# EAGLE schematic samd21g_minimal_board (EAGLE 9.6.2)
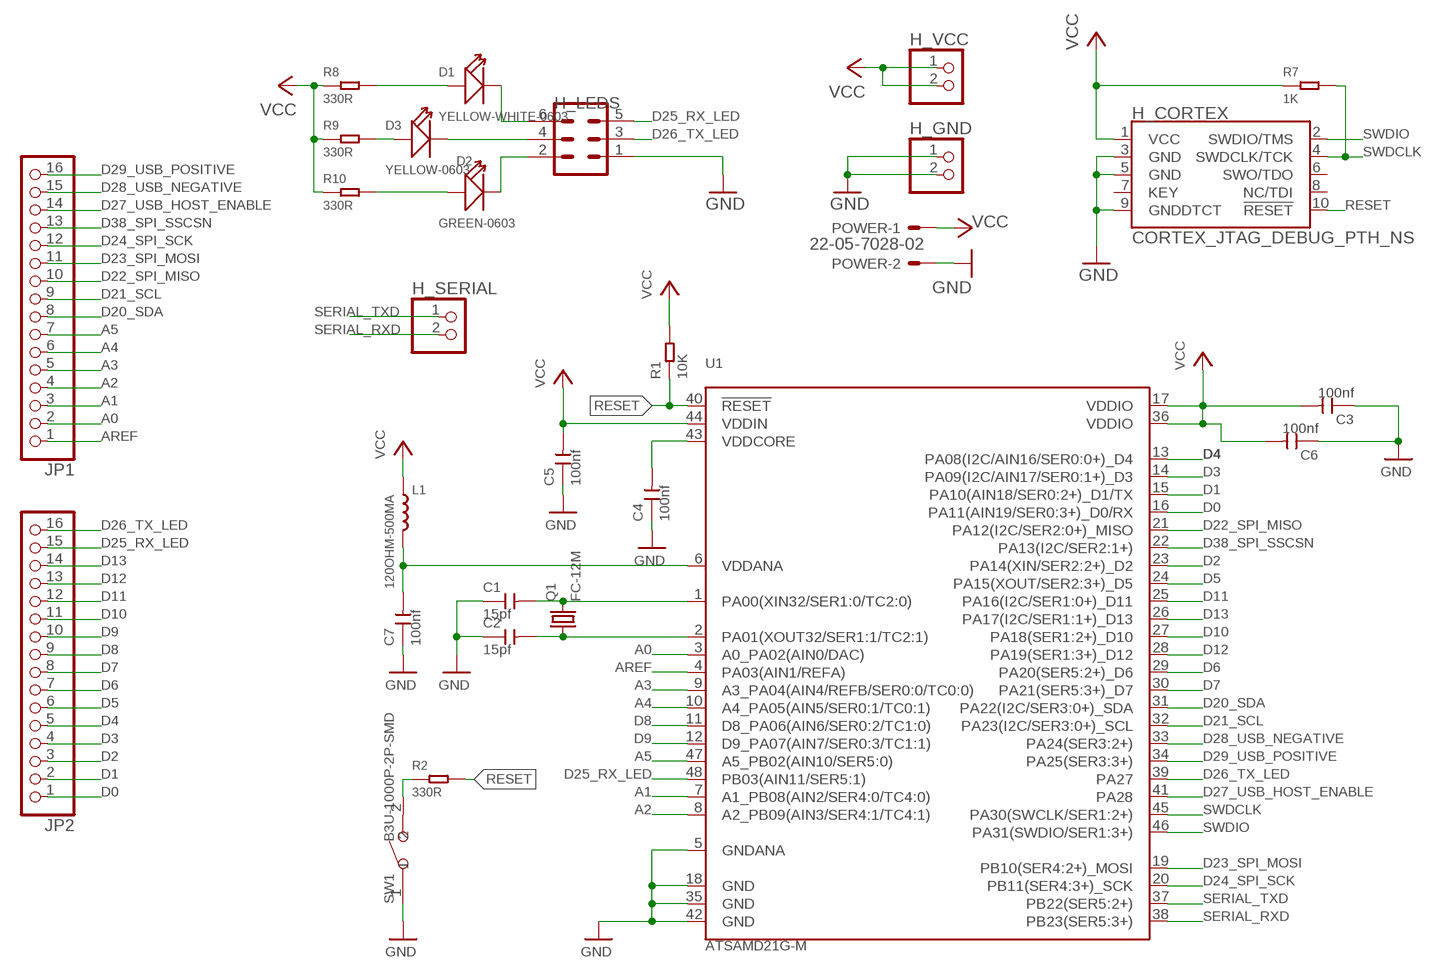
[diagram p0: schematic, sheet 1]

## Parts
C1  15pf  CERAMIC-15PF-50V-5%-NPO(0402)  [C0402]
C2  15pf  CERAMIC-15PF-50V-5%-NPO(0402)  [C0402]
C3  100nf  CERAMIC-100NF-50V-10%-X7R(0805)  [C0805]
C4  100nf  CERAMIC-100NF-50V-10%-X7R(0805)  [C0805]
C5  100nf  CERAMIC-100NF-50V-10%-X7R(0805)  [C0805]
C6  100nf  CERAMIC-100NF-50V-10%-X7R(0805)  [C0805]
C7  100nf  CERAMIC-100NF-50V-10%-X7R(0805)  [C0805]
D1  YELLOW-WHITE-0603  SMD-LED-YELLOW-WHITE(0603)  [LED-0603]
D2  GREEN-0603  SMD-LED-CLEAR-GREEN(0603)  [LED-0603]
D3  YELLOW-0603  SMD-LED-CLEAR-YELLOW(0603)  [LED-0603]
H_CORTEX  CORTEX_JTAG_DEBUG_PTH_NS  [2X5-PTH-1.27MM-NO_SILK]
H_GND  PINHD-1X2  [1X02]
H_LEDS  M_2R03_50MIL-V2  [M_2R03_50MIL-V2]
H_SERIAL  PINHD-1X2  [1X02]
H_VCC  PINHD-1X2  [1X02]
JP1  PINHD-1X16  [1X16]
JP2  PINHD-1X16  [1X16]
L1  120OHM-500MA  SMD-FERRITE-CHIP-120-OHM-500MA(0603)  [L0603]
POWER  22-05-7028-02  [7395-02]
Q1  FC-12M  [FC-12M]
R1  10K  SMD-RES-10K-1%-1/8W(0805)  [R0805]
R2  330R  SMD-RES-330R-1%-1/8W(0805)  [R0805]
R7  1K  SMD-RES-1K-5%-1/8W(0805)  [R0805]
R8  330R  SMD-RES-330R-1%-1/8W(0805)  [R0805]
R9  330R  SMD-RES-330R-1%-1/8W(0805)  [R0805]
R10  330R  SMD-RES-330R-1%-1/8W(0805)  [R0805]
SW1  B3U-1000P-2P-SMD  SMD-BUTTON(2P-3.0X2.5X1.2+0.4MM)-B3U-1000P-2P-SMD  [SW2-2.6-3.0X2.5X1.2+0.4MM]
U1  ATSAMD21G-M  [QFN-48]

## Nets
A0: JP1.2 U1.3(A0_PA02(AIN0/DAC))
A1: JP1.3 U1.7(A1_PB08(AIN2/SER4:0/TC4:0))
A2: JP1.4 U1.8(A2_PB09(AIN3/SER4:1/TC4:1))
A3: JP1.5 U1.9(A3_PA04(AIN4/REFB/SER0:0/TC0:0))
A4: JP1.6 U1.10(A4_PA05(AIN5/SER0:1/TC0:1))
A5: JP1.7 U1.47(A5_PB02(AIN10/SER5:0))
AREF: JP1.1 U1.4(PA03(AIN1/REFA))
D0: JP2.1 U1.16(PA11(AIN19/SER0:3+)_D0/RX)
D1: JP2.2 U1.15(PA10(AIN18/SER0:2+)_D1/TX)
D2: JP2.3 U1.23(PA14(XIN/SER2:2+)_D2)
D3: JP2.4 U1.14(PA09(I2C/AIN17/SER0:1+)_D3)
D4: JP2.5 U1.13(PA08(I2C/AIN16/SER0:0+)_D4)
D5: JP2.6 U1.24(PA15(XOUT/SER2:3+)_D5)
D6: JP2.7 U1.29(PA20(SER5:2+)_D6)
D7: JP2.8 U1.30(PA21(SER5:3+)_D7)
D8: JP2.9 U1.11(D8_PA06(AIN6/SER0:2/TC1:0))
D9: JP2.10 U1.12(D9_PA07(AIN7/SER0:3/TC1:1))
D10: JP2.11 U1.27(PA18(SER1:2+)_D10)
D11: JP2.12 U1.25(PA16(I2C/SER1:0+)_D11)
D12: JP2.13 U1.28(PA19(SER1:3+)_D12)
D13: JP2.14 U1.26(PA17(I2C/SER1:1+)_D13)
D20_SDA: JP1.8 U1.31(PA22(I2C/SER3:0+)_SDA)
D21_SCL: JP1.9 U1.32(PA23(I2C/SER3:0+)_SCL)
D22_SPI_MISO: JP1.10 U1.21(PA12(I2C/SER2:0+)_MISO)
D23_SPI_MOSI: JP1.11 U1.19(PB10(SER4:2+)_MOSI)
D24_SPI_SCK: JP1.12 U1.20(PB11(SER4:3+)_SCK)
D25_RX_LED: H_LEDS.5 JP2.15 U1.48(PB03(AIN11/SER5:1))
D26_TX_LED: H_LEDS.3 JP2.16 U1.39(PA27)
D27_USB_HOST_ENABLE: JP1.14 U1.41(PA28)
D28_USB_NEGATIVE: JP1.15 U1.33(PA24(SER3:2+))
D29_USB_POSITIVE: JP1.16 U1.34(PA25(SER3:3+))
D38_SPI_SSCSN: JP1.13 U1.22(PA13(I2C/SER2:1+))
GND: C1.1 C2.1 C3.1 C4.1 C5.1 C6.1 C7.1 H_CORTEX.3(GND) H_CORTEX.5(GND) H_CORTEX.9(GNDDTCT) H_GND.1 H_GND.2 H_LEDS.1 POWER.2 SW1.1 U1.5(GNDANA) U1.18(GND) U1.35(GND) U1.42(GND)
N$1: C1.2 Q1.2 U1.1(PA00(XIN32/SER1:0/TC2:0))
N$2: C2.2 Q1.1 U1.2(PA01(XOUT32/SER1:1/TC2:1))
N$3: D2.- H_LEDS.2
N$4: D2.+ R10.2
N$5: D1.+ R8.2
N$6: D3.+ R9.2
N$7: D3.- H_LEDS.4
N$8: D1.- H_LEDS.6
N$9: C7.2 L1.2 U1.6(VDDANA)
N$28: R2.1 SW1.2
N$32: C4.2 U1.43(VDDCORE)
RESET: H_CORTEX.10(!RESET) R1.1 R2.2 U1.40(!RESET!)
SERIAL_RXD: H_SERIAL.2 U1.38(PB23(SER5:3+))
SERIAL_TXD: H_SERIAL.1 U1.37(PB22(SER5:2+))
SWDCLK: H_CORTEX.4(SWDCLK/TCK) R7.2 U1.45(PA30(SWCLK/SER1:2+))
SWDIO: H_CORTEX.2(SWDIO/TMS) U1.46(PA31(SWDIO/SER1:3+))
VCC: C3.2 C5.2 C6.2 H_CORTEX.1(VCC) H_VCC.1 H_VCC.2 L1.1 POWER.1 R1.2 R7.1 R8.1 R9.1 R10.1 U1.17(VDDIO) U1.36(VDDIO) U1.44(VDDIN)
Unconnected: H_CORTEX.6(SWO/TDO) H_CORTEX.7(KEY) H_CORTEX.8(NC/TDI)

## Library data of the parts
C1 C2 = OPL_Capacitor:CERAMIC-15PF-50V-5%-NPO(0402): 302010041; MPN: GRM1555C1H150JA01D
C3-C7 = OPL_Capacitor:CERAMIC-100NF-50V-10%-X7R(0805): 302010165; MPN: CC0805KRX7R9BB104
D1 = OPL_Optoelectronics:SMD-LED-YELLOW-WHITE(0603): 304090071; MPN: ADL-0603W
D2 = OPL_Optoelectronics:SMD-LED-CLEAR-GREEN(0603): 304090043; MPN: 19-217-G7C-AN1P2-3T
D3 = OPL_Optoelectronics:SMD-LED-CLEAR-YELLOW(0603): 304090044; MPN: 19-217-Y5C-AM1N1VY-3T
H_CORTEX = SparkFun-Connectors:CORTEX_JTAG_DEBUG: Cortex Debug Connector - 10 pin Supports JTAG debug, Serial Wire debug, and Serial Wire Viewer. PTH and SMD connector options available. General Connector Information <http://infocenter.arm.com/help/topic/com.arm.doc.faqs/attached/13634/cortex_debug_connectors.pdf> Products: PTH Connector <http://www.digikey.com/product-detail/en/cnc-tech/3220-10-0100-00/1175-1627-ND/3883661> -via Digi-Key SparkFun PSoc <https://www.sparkfun.com/products/13229> SparkFun T <https://www.sparkfun.com/products/13810>
H_GND H_SERIAL H_VCC = pinhead:PINHD-1X2: PIN HEADER
H_LEDS = conn-pinhead-male-1.27mm:M_2R03: Pin header, male, 2 rows
JP1 JP2 = pinhead:PINHD-1X16: PIN HEADER
L1 = OPL_Ferrite_and_Magnetic_Bead:SMD-FERRITE-CHIP-120-OHM-500MA(0603): 303030001; MPN: BLM18AG121SN1D
POWER = con-molex:22-?-02: CONNECTOR wire to board 2.54 mm (.1 inch) pitch header; MF: MOLEX; OC_FARNELL: 9731601; OC_NEWARK: unknown
Q1 = crystal:FC-12M: kHz RANGE CRYSTAL UNIT LOW PROFILE SMD Source: Epson Toyocom FC-12M.pdf
R1 = OPL_Resistor:SMD-RES-10K-1%-1/8W(0805): 301012152; MPN: RC0805FR-0710KL
R2 R8-R10 = OPL_Resistor:SMD-RES-330R-1%-1/8W(0805): 301012167; MPN: RC0805FR-07330RL; VALUE: 1K
R7 = OPL_Resistor:SMD-RES-1K-5%-1/8W(0805): 301012189; MPN: RC0805JR-071KL
SW1 = OPL_Switch:SMD-BUTTON(2P-3.0X2.5X1.2+0.4MM): 311020047; MPN: B3U-1000P-2P-SMD; SPICEPREFIX: B
U1 = SparkFun-IC-Microcontroller:ATSAMD21G: Atmel SAMD21G SMART ARM-Based Microcontroller The Atmel ® | SMART ™ SAM D21 is a series of low-power microcontrollers using the 32-bit ARM ® Cortex ® -M0+ processor, and ranging from 32- to 64-pins with up to 256KB Flash and 32KB of SRAM. The SAM D21 devices operate at a maximum frequency of 48MHz and reach 2.46 CoreMark/MHz. They are designed for simple and intuitive migration with identical peripheral modules, hex compatible code, identical linear address map and pin compatible migration paths between all devices in the product series. All devices include intelligent and flexible peripherals, Atmel Event System for inter-peripheral signaling, and support for capacitive touch button, slider and wheel user interfaces. Datasheet <https://cdn.sparkfun.com/datasheets/Dev/Arduino/Boards/Atmel-42181-SAM-D21_Datasheet.pdf> SparkFun Products SparkFun SAMD21 Mini Breakout <https://www.sparkfun.com/products/13664> (DEV-13664) SparkFun SAMD21 Dev Breakout <https://www.sparkfun.com/products/13672> (DEV-13672) (DEV-14926); PROD_ID: IC-13064